# EAGLE design MyDoorSensor (EAGLE 6.5.0)
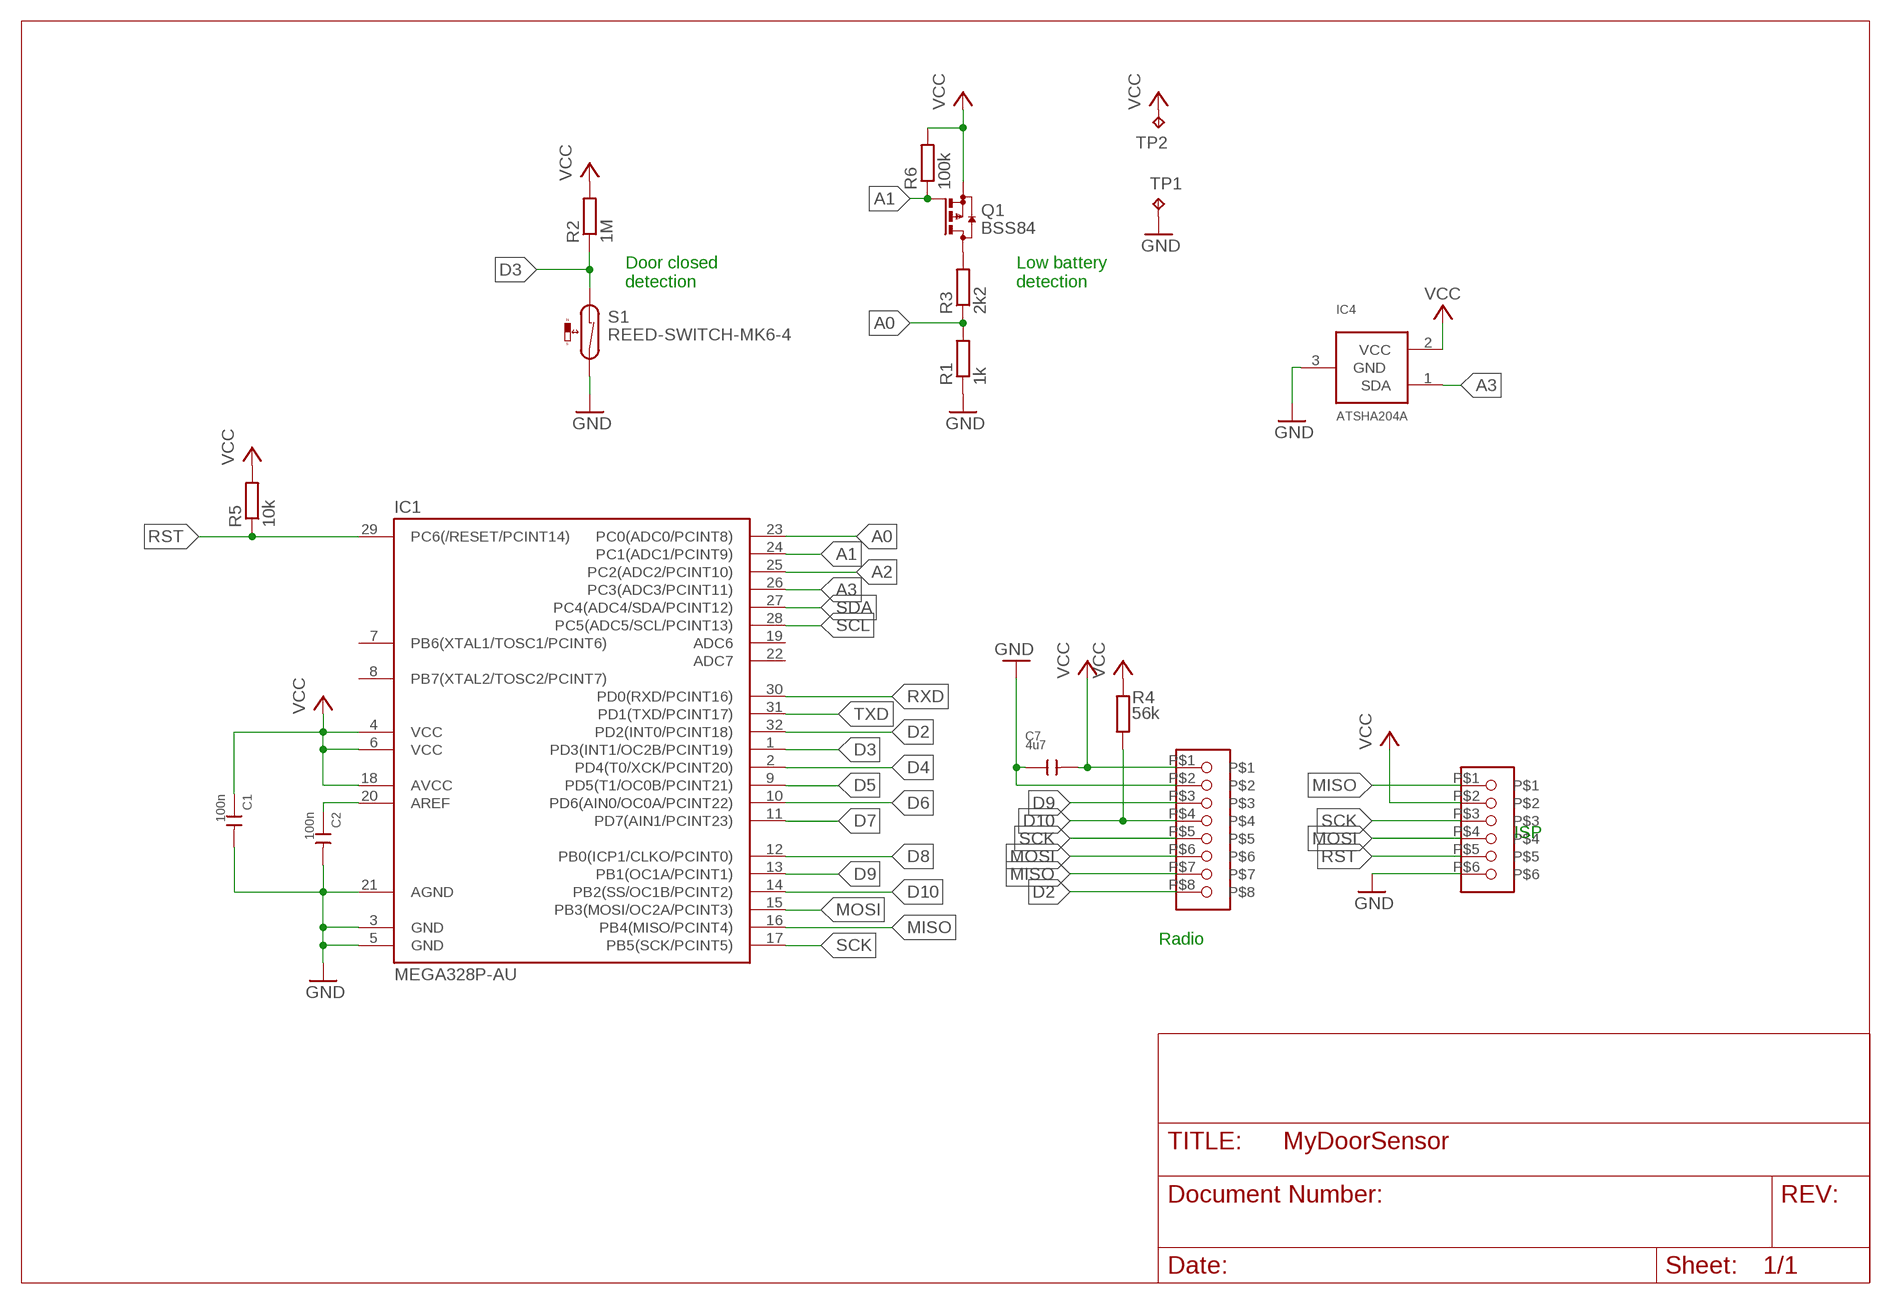
[diagram p0: schematic, sheet 1]

## Parts
C1  100n  CAP-0603  [C0603]
C2  100n  CAP-0603  [C0603]
C7  4u7  CAP-0805  [C0805]
IC1  MEGA328P-AU  MEGA48/88/168-AU  [TQFP32-08]
IC4  ATSHA204A  [SOT23]
Q1  BSS84  [SOT23]
R1  1k  R-EU_R0805  [R0805]
R2  1M  R-EU_R0805  [R0805]
R3  2k2  R-EU_R0805  [R0805]
R4  56k  R-EU_R0805  [R0805]
R5  10k  R-EU_R0805  [R0805]
R6  100k  R-EU_R0805  [R0805]
S1  REED-SWITCH-MK6-4  [MK6-4]
TP1  TPPAD1-13  [P1-13]
TP2  TPPAD1-13  [P1-13]
U$1  NRF24  [PINHD-1X08/NRF24]
U$2  ISP  [ISP]

## Nets
A0: IC1.23(PC0(ADC0/PCINT8)) R1.2 R3.1
A1: IC1.24(PC1(ADC1/PCINT9)) Q1.1(G) R6.1
A2: IC1.25(PC2(ADC2/PCINT10))
A3: IC1.26(PC3(ADC3/PCINT11)) IC4.1(SDA)
D2: IC1.32(PD2(INT0/PCINT18)) U$1.P$8
D3: IC1.1(PD3(INT1/OC2B/PCINT19)) R2.1 S1.1
D4: IC1.2(PD4(T0/XCK/PCINT20))
D5: IC1.9(PD5(T1/OC0B/PCINT21))
D6: IC1.10(PD6(AIN0/OC0A/PCINT22))
D7: IC1.11(PD7(AIN1/PCINT23))
D8: IC1.12(PB0(ICP1/CLKO/PCINT0))
D9: IC1.13(PB1(OC1A/PCINT1)) U$1.P$3
D10: IC1.14(PB2(SS/OC1B/PCINT2)) R4.1 U$1.P$4
GND [Power]: C1.2 C2.2 C7.1 IC1.3(GND) IC1.5(GND) IC1.21(AGND) IC4.3(GND) R1.1 S1.2 TP1.TP U$1.P$2 U$2.P$6
MISO: IC1.16(PB4(MISO/PCINT4)) U$1.P$7 U$2.P$1
MOSI: IC1.15(PB3(MOSI/OC2A/PCINT3)) U$1.P$6 U$2.P$4
N$2: Q1.3(D) R3.2
N$4: C2.1 IC1.20(AREF)
RST: IC1.29(PC6(/RESET/PCINT14)) R5.1 U$2.P$5
RXD: IC1.30(PD0(RXD/PCINT16))
SCK: IC1.17(PB5(SCK/PCINT5)) U$1.P$5 U$2.P$3
SCL: IC1.28(PC5(ADC5/SCL/PCINT13))
SDA: IC1.27(PC4(ADC4/SDA/PCINT12))
TXD: IC1.31(PD1(TXD/PCINT17))
VCC [Power]: C1.1 C7.2 IC1.4(VCC) IC1.6(VCC) IC1.18(AVCC) IC4.2(VCC) Q1.2(S) R2.2 R4.2 R5.2 R6.2 TP2.TP U$1.P$1 U$2.P$2
Unconnected: IC1.7(PB6(XTAL1/TOSC1/PCINT6)) IC1.8(PB7(XTAL2/TOSC2/PCINT7)) IC1.19(ADC6) IC1.22(ADC7)

## Notes on the sheet
- Door closed
  detection
- Low battery
  detection
- ISP
- Radio

## Library data of the parts
C1 C2 C7 = Discrete:CAP: Ceramic Capacitors
IC1 = avr-7:MEGA48/88/168
IC4 = Sensor:ATSHA204A
Q1 = transistor-small-signal:BSS84: P-CHANNEL MOS FET
R1-R6 = resistor:R-EU_: RESISTOR, European symbol
S1 = switch-reed:REED-SWITCH-: Reed Sensor; OC_FARNELL: unknown
TP1 TP2 = testpad:TP: Test pad
U$1 = mylbr:NRF24
U$2 = mylbr:ISP

## Net classes
0 default: width 0.203 mm
1 Power: width 0.406 mm

## Board
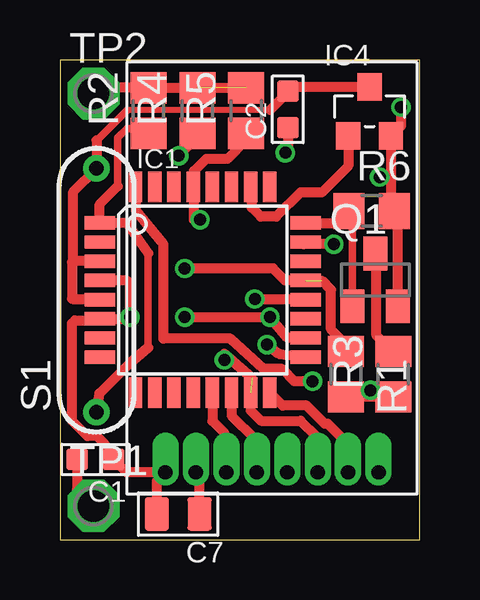
[diagram p1: board, top side]
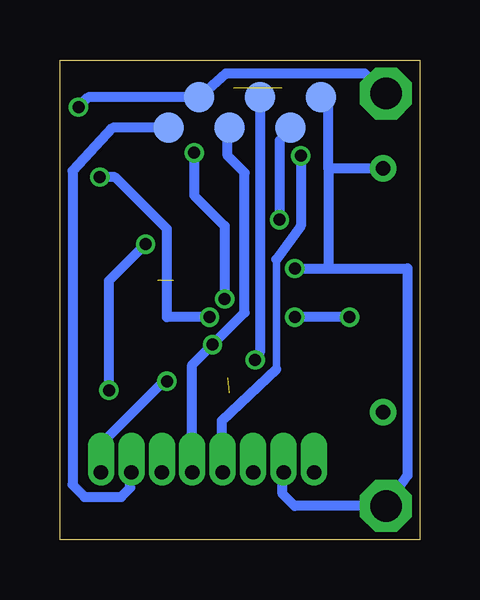
[diagram p2: board, bottom side, seen from below]

Size 15 x 20 mm. Coordinates in mm from the lower left corner, seen from the top.
Outline: 0,0 15,0 15,20 0,20 0,0
Copper layers (1*16): Top 0.035mm / dielectric 1.5mm / Bottom 0.035mm
Design rules "ITEADstudioDRC": minimum track width 6mil, minimum drill 12mil, track to track 6mil, track to pad 6mil, pad to pad 6mil, via to via 6mil, smd to smd 0mil, copper to edge 10mil, drill to drill 10mil, minimum pad ring 10mil, minimum via ring 6mil, stop-mask expansion 2mil, vias tented up to drill 100mil, thermal gap 10mil

### Footprints (pad centres in the part's own frame; a part is rotated, then mirrored left to right if it is on the bottom)
C0603 = smd 0.889 x 0.889: 1 -0.762,0; 2 0.762,0
C0805 = smd 1.016 x 1.397: 1 -0.889,0; 2 0.889,0
TQFP32-08 = smd 1.27 x 0.559: 1 -4.293,2.8; 2 -4.293,2; 3 -4.293,1.2; 4 -4.293,0.4; 5 -4.293,-0.4; 6 -4.293,-1.2; 7 -4.293,-2; 8 -4.293,-2.8; 17 4.293,-2.8; 18 4.293,-2; 19 4.293,-1.2; 20 4.293,-0.4; 21 4.293,0.4; 22 4.293,1.2; 23 4.293,2; 24 4.293,2.8 | smd 0.559 x 1.27: 9 -2.8,-4.293; 10 -2,-4.293; 11 -1.2,-4.293; 12 -0.4,-4.293; 13 0.4,-4.293; 14 1.2,-4.293; 15 2,-4.293; 16 2.8,-4.293; 25 2.8,4.293; 26 2,4.293; 27 1.2,4.293; 28 0.4,4.293; 29 -0.4,4.293; 30 -1.2,4.293; 31 -2,4.293; 32 -2.8,4.293
SOT23 = smd 1.016 x 1.143: 1 -0.889,-1.016; 2 0.889,-1.016; 3 0,1.016
SOT23' = smd 1 x 1.4: 1 -0.95,-1.1; 2 0.95,-1.1; 3 0,1.1
R0805 = smd 1.3 x 1.5: 1 -0.95,0; 2 0.95,0
MK6-4 = drill 0.6 pad 1.016: 1 -5.08,0; 2 5.08,0
P1-13 = drill 1.321 pad 2.159 octagon: TP 0,0
PINHD-1X08/NRF24 = drill 0.6 offset: P$1 0,0; P$2 1.27,0; P$3 2.54,0; P$4 3.81,0; P$5 5.08,0; P$6 6.35,0; P$7 7.62,0; P$8 8.89,0
ISP = smd 1.27 x 1.27: P$1 0,0; P$2 1.27,1.27; P$3 2.54,0; P$4 3.81,1.27; P$5 5.08,0; P$6 6.35,1.27

### Placement (x,y rotation side)
C1  1.48,3.34 180 top
C2  9.51,17.94 90 top
C7  4.93,1.06 180 top
IC1  5.96,10.41 0 top
IC4  12.91,17.86 0 top
Q1  BSS84  [SOT23']  13.15,10.83 0 top
R1  11.93,6.9 270 top
R2  3.7,17.89 90 top
R3  13.9,6.9 90 top
R4  5.73,17.89 90 top
R5  7.77,17.89 90 top
R6  13,13.7 0 top
S1  1.53,10.4 90 top
TP1  1.4,1.4 0 top
TP2  1.4,18.6 0 top
U$1  4.4,2.8 0 top
U$2  10.47,17.17 0 bottom

### Tracks (layer width: path | path; a pad name or v marks a point on that pad's centre or on a via)
A0  (via drill 0.5)
  Top 0.406: R3.1 R1.2 12.59,5.95 v12.95,6.22 | v11.43,12.32 10.16,12.32 IC1.23
  Bottom 0.406: v12.95,6.22 12.95,10.79 v11.43,12.32
A1
  Top 0.305: Q1.1 12.32,9.73 12.19,9.91 12.2,13.21
  Top 0.406: R6.1 11.95,13.6 12.2,13.21 IC1.24
A3
  Top 0.406: IC4.1 12.03,15.58 10.92,14.48 10.03,14.48 9.02,13.46 8.38,13.46 8,13.84 8,14.66 IC1.26
D2  (via drill 0.5)
  Top 0.406: v10.54,6.6 9.78,6.6 9.27,7.11 8.51,7.11 7.11,8.38 4.32,8.38 4.32,12.32 3.17,13.72 3.17,14.68 IC1.32
  Bottom 0.406: U$1.P$8 13.29,3.98 10.67,6.6 v10.54,6.6
D3
  Top 0.305: 3.68,8 3.68,11.94 | 2.41,14.73 2.41,16.76 2.79,17.14 3.49,17.14
  Top 0.406: S1.1 1.66,6.1 2.92,7.37 3.68,8 | 3.68,11.94 2.79,13.21 IC1.1 1.67,13.98 2.41,14.73 | 3.49,17.14 R2.1
D9
  Top 0.406: IC1.13 6.36,4.95 6.86,4.45 6.86,2.88 U$1.P$3
D10  (via drill 0.5)
  Top 0.406: IC1.14 7.16,5.16 8.13,4.19 8.13,2.88 U$1.P$4 | R4.1 5.73,16.78 v4.95,16
  Bottom 0.305: 5.97,11.68 5.97,7.11
  Bottom 0.406: v4.95,16 4.95,13.08 5.97,11.68 | 5.97,7.11 8.26,4.95 8.26,2.85 U$1.P$4
GND  (via drill 0.5)  (1 unrouted)
  Top 0.254: 8.76,17.91 2.79,17.91
  Top 0.305: 2.79,17.91 1.52,16.64
  Top 0.406: C7.1 5.82,2.65 U$1.P$2 | C1.2 0.72,2.08 TP1.TP | IC4.3 9.68,18.87 C2.2 9.51,18.65 8.76,17.91 | IC1.3 0.56,11.61 | 0.56,11.61 0.51,11.56 0.51,10.03 1.64,10.03 IC1.5 | 0.56,11.61 0.56,14.51 S1.2 1.52,16.64 | R1.1 11.93,8.14 11.3,8.76 11.3,10.41 10.92,10.79 | IC1.21 9.38,10.81 8.89,11.3 v5.21,11.3
  Bottom 0.406: U$1.P$2 5.71,2.75 5.71,1.91 5.21,1.4 TP1.TP 0.51,2.67 0.51,11.3 3.81,11.3 | S1.2 3.81,15.48 | 3.81,15.48 3.81,11.3 | v5.21,11.3 3.81,11.3 | 3.81,15.48 3.81,18.51 U$2.P$6
MISO
  Top 0.406: U$1.P$7 12.02,3.98 11.18,4.83 11.05,4.83 10.29,5.59 9.29,5.59 IC1.16
  Bottom 0.406: U$2.P$1 12.8,17.17 14.48,15.37 14.48,2.29 13.97,1.78 12.45,1.78 12.06,2.16 12.06,2.75 U$1.P$7
MOSI  (via drill 0.5)  (1 unrouted)
  Top 0.406: IC1.15 7.96,5.38 8.38,4.95 10.03,4.95 10.67,4.32 10.67,2.88 U$1.P$6 | v6.86,7.49 6.86,7.75 8,6.73
  Bottom 0.406: U$2.P$4 6.66,7.81 v6.86,7.49
N$2
  Top 0.406: R3.2 13.87,7.85 13.21,8.51 13.21,11.49 Q1.3
N$4  (via drill 0.5)
  Top 0.406: C2.1 9.51,16.24 v9.4,16.13 | v8.13,10.03 10.23,10.03 IC1.20
  Bottom 0.406: v9.4,16.13 9.4,14.35 8.13,13.08 v8.13,10.03
RST  (via drill 0.5)
  Top 0.406: v5.84,13.34 5.59,13.34 5.59,14.67 IC1.29 5.59,14.73 5.59,15.37 6.1,15.88 6.99,15.88 7.77,16.66 R5.1
  Bottom 0.406: U$2.P$5 5.65,16.83 5.84,16.64 v5.84,13.34
SCK  (via drill 0.5)
  Top 0.406: v8.64,8.13 9.14,7.75 IC1.17
  Bottom 0.406: U$1.P$5 9.48,7.28 v8.64,8.13 7.3,9.47 7.3,15.3 8,16 8,16.98 U$2.P$3
VCC  (via drill 0.5)  (1 unrouted)
  Top 0.406: C7.2 4.04,2.44 U$1.P$1 2.78,2.8 C1.1 2.24,3.6 1.52,4.32 1.14,4.32 0.51,4.95 0.51,9.02 0.64,9.14 1.6,9.14 IC1.6 2.86,9.21 v2.92,9.27 2.92,10.67 2.79,10.79 1.68,10.79 IC1.4 | Q1.2 14.1,13.6 R6.2 13.8,13.85 13.8,15.11 | 13.8,15.11 IC4.2 14.22,17.26 v14.22,18.03 | R5.2 R2.2 1.64,18.84 TP2.TP | IC1.18 9.5,8.41 v8.76,9.27 v5.21,9.27 | v13.34,15.11 13.8,15.11
  Bottom 0.406: TP2.TP 1.46,18.6 2.29,19.43 8.09,19.43 U$2.P$2 13.81,18.44 v14.22,18.03 | v8.76,9.27 10.54,9.27 10.54,12.95 12.7,15.11 v13.34,15.11 | v2.92,9.27 v5.21,9.27